# EAGLE schematic dobbelsteen (EAGLE 6.5.0)
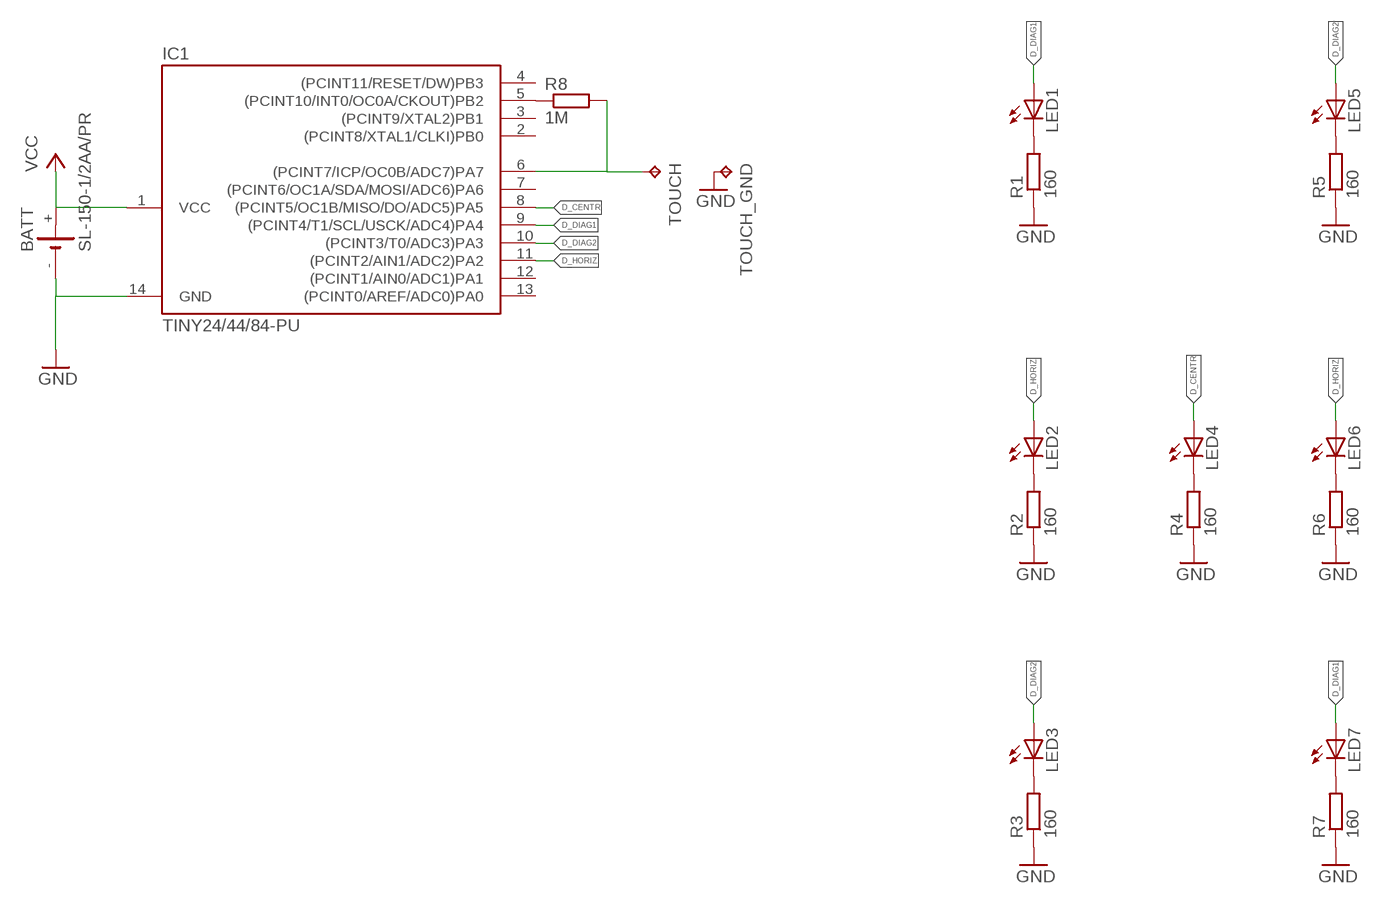
[diagram p0: schematic, sheet 1]

## Parts
BATT  SL-150-1/2AA/PR  [SL-150-1/2AA/PR]
IC1  TINY24/44/84-PU  [DIL14]
LED1  LED5MM  [LED5MM]
LED2  LED5MM  [LED5MM]
LED3  LED5MM  [LED5MM]
LED4  LED5MM  [LED5MM]
LED5  LED5MM  [LED5MM]
LED6  LED5MM  [LED5MM]
LED7  LED5MM  [LED5MM]
R1  160  R-EU_0204/7  [0204/7]
R2  160  R-EU_0204/7  [0204/7]
R3  160  R-EU_0204/7  [0204/7]
R4  160  R-EU_0204/7  [0204/7]
R5  160  R-EU_0204/7  [0204/7]
R6  160  R-EU_0204/7  [0204/7]
R7  160  R-EU_0204/7  [0204/7]
R8  1M  R-EU_0204/7  [0204/7]
TOUCH  TPPAD1-20Y  [P1-20Y]
TOUCH_GND  TPPAD1-20Y  [P1-20Y]

## Nets
D_CENTR: IC1.8((PCINT5/OC1B/MISO/DO/ADC5)PA5) LED4.A
D_DIAG1: IC1.9((PCINT4/T1/SCL/USCK/ADC4)PA4) LED1.A LED7.A
D_DIAG2: IC1.10((PCINT3/T0/ADC3)PA3) LED3.A LED5.A
D_HORIZ: IC1.11((PCINT2/AIN1/ADC2)PA2) LED2.A LED6.A
GND: BATT.- IC1.14(GND) R1.1 R2.1 R3.1 R4.1 R5.1 R6.1 R7.1 TOUCH_GND.TP
N$1: LED1.K(C) R1.2
N$2: LED2.K(C) R2.2
N$3: LED3.K(C) R3.2
N$4: LED4.K(C) R4.2
N$5: LED5.K(C) R5.2
N$6: LED6.K(C) R6.2
N$7: LED7.K(C) R7.2
N$8: IC1.5((PCINT10/INT0/OC0A/CKOUT)PB2) R8.1
TOUCH: IC1.6((PCINT7/ICP/OC0B/ADC7)PA7) R8.2 TOUCH.TP
VCC: BATT.+ IC1.1(VCC)
Unconnected: IC1.2((PCINT8/XTAL1/CLKI)PB0) IC1.3((PCINT9/XTAL2)PB1) IC1.4((PCINT11/RESET/DW)PB3) IC1.7((PCINT6/OC1A/SDA/MOSI/ADC6)PA6) IC1.12((PCINT1/AIN0/ADC1)PA1) IC1.13((PCINT0/AREF/ADC0)PA0)

## Library data of the parts
BATT = battery:SL-150-1/2AA/PR: LI BATTERY Sonnenschein
IC1 = avr-7:TINY24/44/84
LED1-LED7 = led:LED: LED OSRAM: - CHIPLED LG R971, LG N971, LY N971, LG Q971, LY Q971, LO R971, LY R971 LH N974, LH R974 LS Q976, LO Q976, LY Q976 LO Q996 - Hyper CHIPLED LW Q18S LB Q993, LB Q99A, LB R99A - SideLED LS A670, LO A670, LY A670, LG A670, LP A670 LB A673, LV A673, LT A673, LW A673 LH A674 LY A675 LS A676, LA A676, LO A676, LY A676, LW A676 LS A679, LY A679, LG A679 - Hyper Micro SIDELED® LS Y876, LA Y876, LO Y876, LY Y876 LT Y87S - SmartLED LW L88C, LW L88S LB L89C, LB L89S, LG L890 LS L89K, LO L89K, LY L89K LS L896, LA L896, LO L896, LY L896 - TOPLED LS T670, LO T670, LY T670, LG T670, LP T670 LSG T670, LSP T670, LSY T670, LOP T670, LYG T670 LG T671, LOG T671, LSG T671 LB T673, LV T673, LT T673, LW T673 LH T674 LS T676, LA T676, LO T676, LY T676, LB T676, LH T676, LSB T676, LW T676 LB T67C, LV T67C, LT T67C, LS T67K, LO T67K, LY T67K, LW E67C LS E67B, LA E67B, LO E67B, LY E67B, LB E67C, LV E67C, LT E67C LW T67C LS T679, LY T679, LG T679 LS T770, LO T770, LY T770, LG T770, LP T770 LB T773, LV T773, LT T773, LW T773 LH T774 LS E675, LA E675, LY E675, LS T675 LS T776, LA T776, LO T776, LY T776, LB T776 LHGB T686 LT T68C, LB T68C - Hyper Mini TOPLED® LB M676 - Mini TOPLED Santana® LG M470 LS M47K, LO M47K, LY M47K Source: http://www.osram.convergy.de LUXEON: - LUMILED® LXK2-PW12-R00, LXK2-PW12-S00, LXK2-PW14-U00, LXK2-PW14-V00 LXK2-PM12-R00, LXK2-PM12-S00, LXK2-PM14-U00 LXK2-PE12-Q00, LXK2-PE12-R00, LXK2-PE12-S00, LXK2-PE14-T00, LXK2-PE14-U00 LXK2-PB12-K00, LXK2-PB12-L00, LXK2-PB12-M00, LXK2-PB14-N00, LXK2-PB14-P00, LXK2-PB14-Q00 LXK2-PR12-L00, LXK2-PR12-M00, LXK2-PR14-Q00, LXK2-PR14-R00 LXK2-PD12-Q00, LXK2-PD12-R00, LXK2-PD12-S00 LXK2-PH12-R00, LXK2-PH12-S00 LXK2-PL12-P00, LXK2-PL12-Q00, LXK2-PL12-R00 Source: www.luxeon.com KINGBRIGHT: KA-3528ASYC Source: www.kingbright.com
R1-R8 = rcl:R-EU_: RESISTOR, European symbol
TOUCH TOUCH_GND = testpad:TP: Test pad